# EAGLE board LibreSolar_BMS48V (EAGLE 7.6.0)
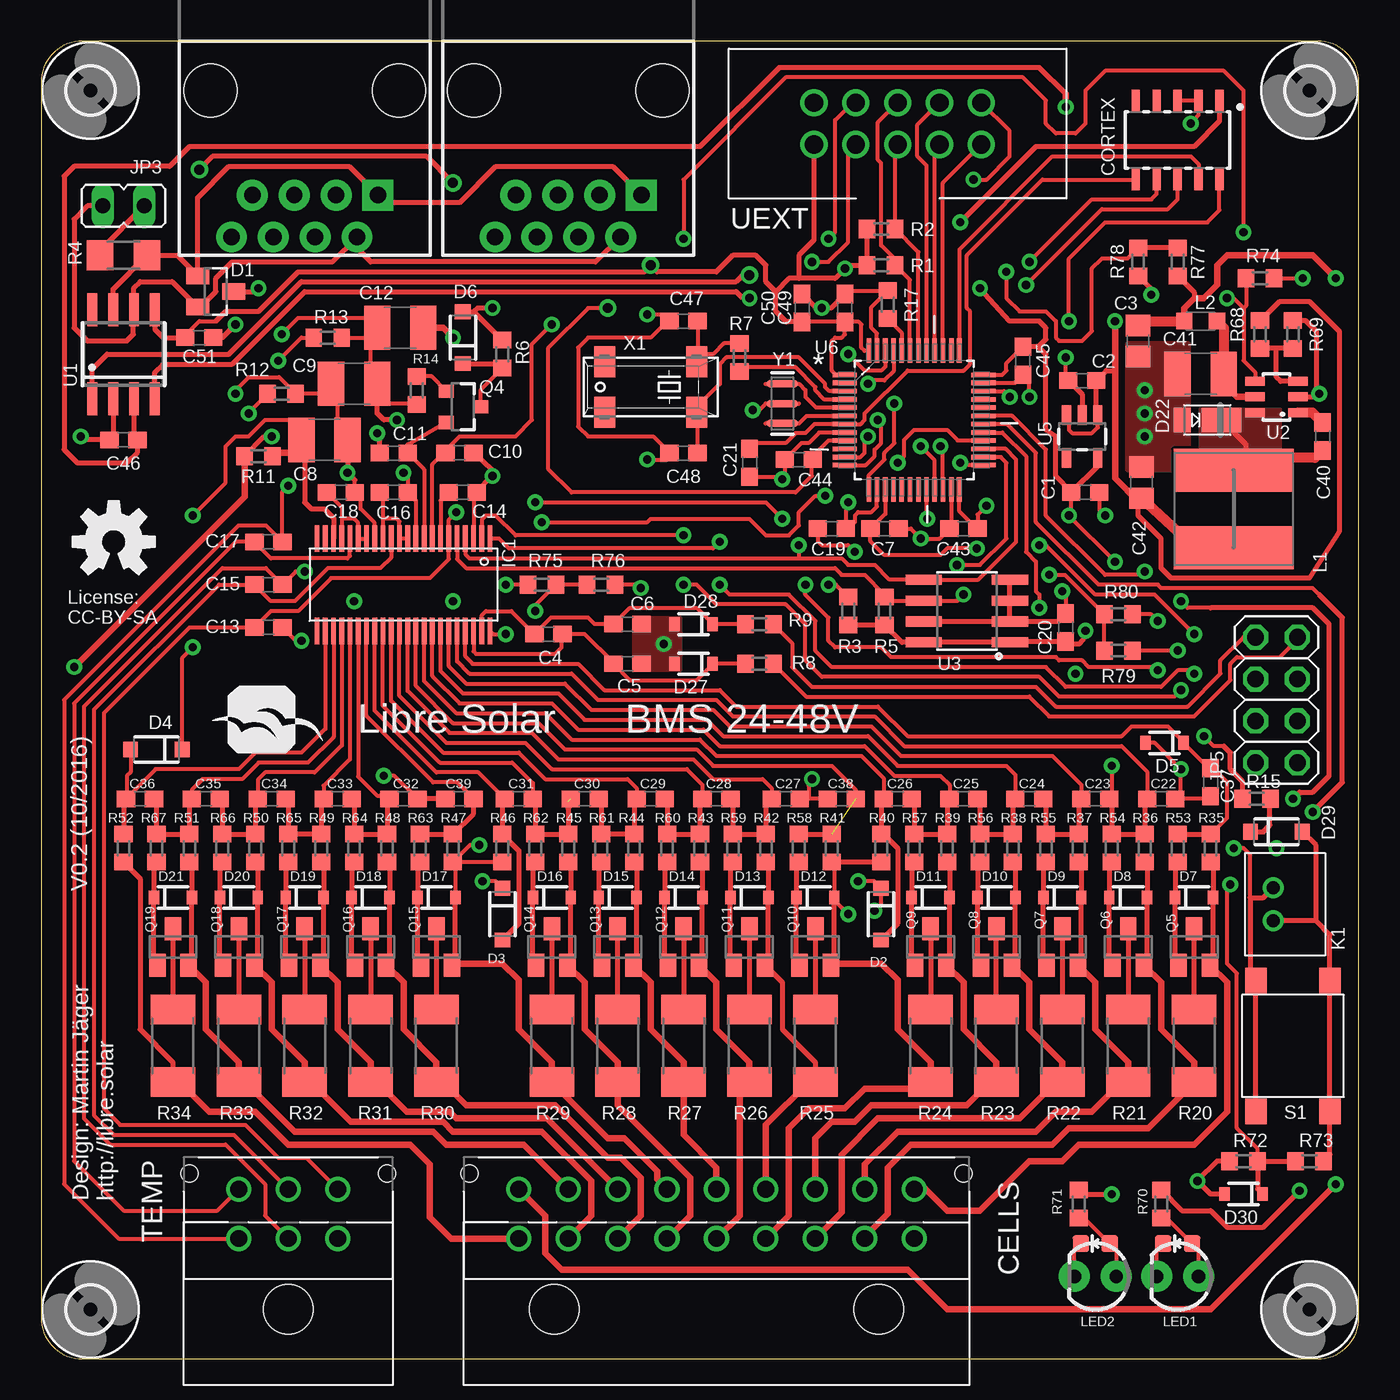
[diagram p2: board, top side]
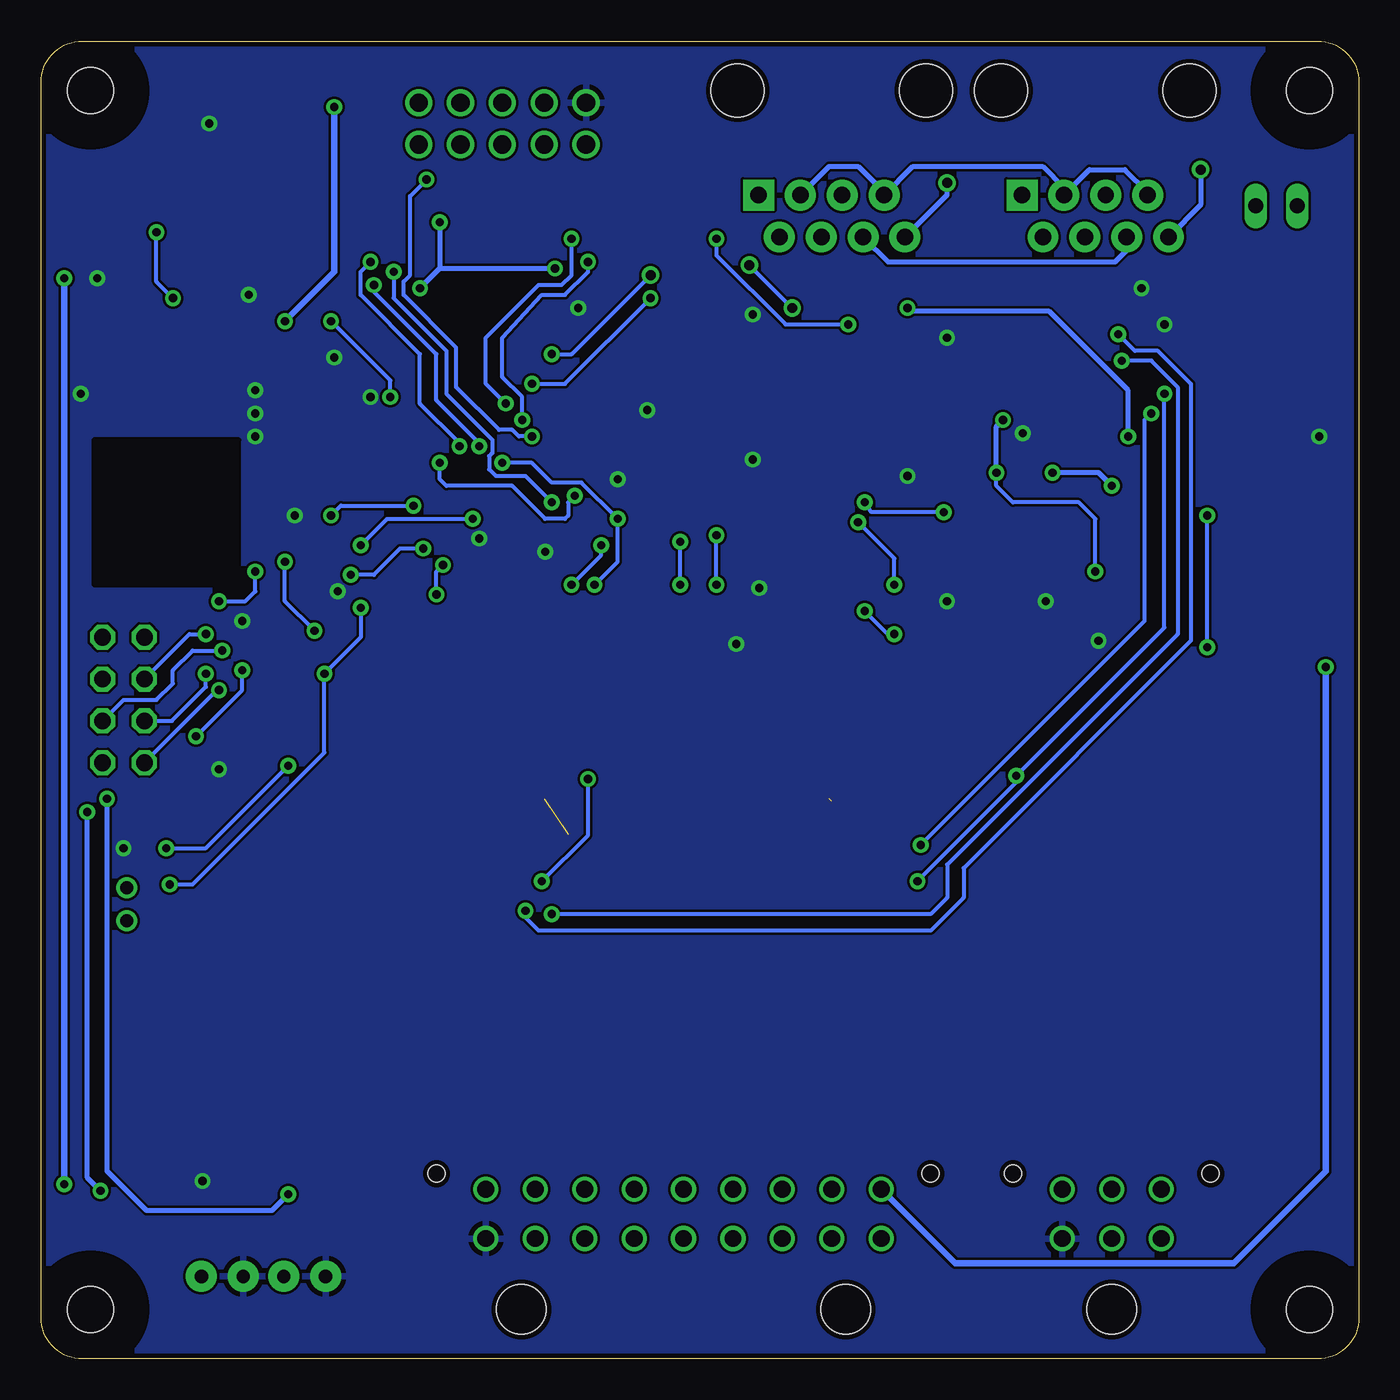
[diagram p3: board, bottom side, seen from below]

Size 80 x 80 mm. Coordinates in mm from the lower left corner, seen from the top.
Outline: 0,77.5 0,2.5 arc90 2.5,0 77.5,0 arc90 80,2.5 80,77.5 arc90 77.5,80 2.5,80 arc90 0,77.5
Copper layers (1*2+3*4+5*6+7*16): Top 0.035mm / dielectric 0.2mm / layer 2 0.035mm / dielectric 0.15mm / layer 3 0.035mm / dielectric 0.2mm / layer 4 0.035mm / dielectric 0.15mm / layer 5 0.035mm / dielectric 0.2mm / layer 6 0.035mm / dielectric 0.15mm / layer 7 0.035mm / dielectric 0.2mm / Bottom 0.035mm
Design rules "Eagle_WEdirekt_150_check": minimum track width 6mil, minimum drill 0.25mm, track to track 6mil, track to pad 8mil, pad to pad 8mil, via to via 6mil, smd to smd 8mil, copper to edge 12mil, drill to drill 24mil, minimum pad ring 9mil, minimum via ring 9mil, stop-mask expansion 3mil, vias tented up to drill 0mil, thermal gap 12mil
Net classes: 0 default: width 0.203 mm, drill 0.3 mm, clearance 0.152 mm; 1 power: width 0.203 mm, drill 0.5 mm, clearance 0.152 mm; 2 VIN: width 0.203 mm, drill 0.3 mm, clearance 0.152 mm
bRestrict: area 68,47 to 76.8,55.8

## Footprints (pad centres in the part's own frame; a part is rotated, then mirrored left to right if it is on the bottom)
C0603 = smd 1.1 x 1: 1 -0.85,0; 2 0.85,0
C0805 = smd 1.3 x 1.5: 1 -0.95,0; 2 0.95,0
C1210 = smd 1.6 x 2.7: 1 -1.4,0; 2 1.4,0
66201821022 = drill 1.02: 1 12,4.3; 2 9,4.3; 3 6,4.3; 4 3,4.3; 5 0,4.3; 6 -3,4.3; 7 -6,4.3; 8 -9,4.3; 9 -12,4.3; 10 12,7.3; 11 9,7.3; 12 6,7.3; 13 3,7.3; 14 0,7.3; 15 -3,7.3; 16 -6,7.3; 17 -9,7.3; 18 -12,7.3 | hole 3: 9.85,0; -9.85,0
SAMTECH_FTSH-105-01 = smd 0.508 x 1.27: 1 -2.54,-2.413; 2 -2.54,2.413; 3 -1.27,-2.413; 4 -1.27,2.413; 5 0,-2.413; 6 0,2.413; 7 1.27,-2.413; 8 1.27,2.413; 9 2.54,-2.413; 10 2.54,2.413
SOT23 = smd 1 x 1.4: 1 -0.95,-1.1; 2 0.95,-1.1; 3 0,1.1
SOD-123 = smd 0.9 x 0.95: A 1.575,0; C -1.575,0
SOD-323 = smd 0.63 x 0.83: A 1.15,0; C -1.15,0
POWERDI123 = smd 1.05 x 1.5: A -1.525,0 | smd 2.4 x 1.5: C 0.85,0
LED-0603 = smd 1 x 1: A 0,-0.877; C 0,0.877
2,8 = hole 2.8: 0,0
TSSOP44 = smd 1.6 x 0.29: 1 -2.8,5.25; 2 -2.8,4.75; 3 -2.8,4.25; 4 -2.8,3.75; 5 -2.8,3.25; 6 -2.8,2.75; 7 -2.8,2.25; 8 -2.8,1.75; 9 -2.8,1.25; 10 -2.8,0.75; 11 -2.8,0.25; 12 -2.8,-0.25; 13 -2.8,-0.75; 14 -2.8,-1.25; 15 -2.8,-1.75; 16 -2.8,-2.25; 17 -2.8,-2.75; 18 -2.8,-3.25; 19 -2.8,-3.75; 20 -2.8,-4.25; 21 -2.8,-4.75; 22 -2.8,-5.25; 23 2.8,-5.25; 24 2.8,-4.75; 25 2.8,-4.25; 26 2.8,-3.75; 27 2.8,-3.25; 28 2.8,-2.75; 29 2.8,-2.25; 30 2.8,-1.75; 31 2.8,-1.25; 32 2.8,-0.75; 33 2.8,-0.25; 34 2.8,0.25; 35 2.8,0.75; 36 2.8,1.25; 37 2.8,1.75; 38 2.8,2.25; 39 2.8,2.75; 40 2.8,3.25; 41 2.8,3.75; 42 2.8,4.25; 43 2.8,4.75; 44 2.8,5.25
RJ45-8 = drill 1 pad 1.88 square: 1 -4.445,6.35 | drill 1 pad 1.88: 2 -3.175,8.89; 3 -1.905,6.35; 4 -0.635,8.89; 5 0.635,6.35; 6 1.905,8.89; 7 3.175,6.35; 8 4.445,8.89 | hole 3.2: -5.715,0; 5.715,0
JP1 = drill 0.914 long: 1 0,-1.27; 2 0,1.27
2X04 = drill 1.016 octagon: 1 -3.81,-1.27; 2 -3.81,1.27; 3 -1.27,-1.27; 4 -1.27,1.27; 5 1.27,-1.27; 6 1.27,1.27; 7 3.81,-1.27; 8 3.81,1.27
62000211622 = drill 0.8: 1 1,0; 2 -1,0
66200621122 = drill 1.02: 1 3,-1.5; 2 0,-1.5; 3 -3,-1.5; 4 3,1.5; 5 0,1.5; 6 -3,1.5 | hole 1.02: -6,2.44; 6,2.44
66201821122 = drill 1.02: 1 12,-1.5; 2 9,-1.5; 3 6,-1.5; 4 3,-1.5; 5 0,-1.5; 6 -3,-1.5; 7 -6,-1.5; 8 -9,-1.5; 9 -12,-1.5; 10 12,1.5; 11 9,1.5; 12 6,1.5; 13 3,1.5; 14 0,1.5; 15 -3,1.5; 16 -6,1.5; 17 -9,1.5; 18 -12,1.5 | hole 1.02: -15,2.44; 15,2.44
WE-TPC_6823 = smd 2.6 x 7.3: 1 -2.35,0; 2 2.35,0
L2012C = smd 1 x 1: 1 -1,0; 2 1,0
LED3MM = drill 0.813 pad 1.88: A -1.27,0; K 1.27,0
SOT23-3 = smd 0.8 x 0.9: 1 -0.95,-1; 2 0.95,-1; 3 0,1.1
R0603 = smd 1 x 1.1: 1 -0.85,0; 2 0.85,0
R1206 = smd 1.6 x 1.803: 1 -1.422,0; 2 1.422,0
R2010 = smd 1.8 x 2.7: 1 -2.2,0; 2 2.2,0
430182050816 = smd 1.55 x 1.3: 1 -3.975,2.25; 2 -3.975,-2.25; 3 3.975,2.25; 4 3.975,-2.25
66200621022 = drill 1.02: 1 3,4.3; 2 0,4.3; 3 -3,4.3; 4 3,7.3; 5 0,7.3; 6 -3,7.3 | hole 3: 0,0
SOIC-8-N = smd 0.6 x 2: 1 -1.905,-2.7; 2 -0.635,-2.7; 3 0.635,-2.7; 4 1.905,-2.7; 5 1.905,2.7; 6 0.635,2.7; 7 -0.635,2.7; 8 -1.905,2.7
SOT23-6 = smd 0.55 x 1.2: 1 0.95,1.3; 2 0,1.3; 3 -0.95,1.3; 4 -0.95,-1.3; 5 0,-1.3; 6 0.95,-1.3
SO08 = smd 0.61 x 2.21: 1 -1.905,-2.616; 2 -0.635,-2.616; 3 0.635,-2.616; 4 1.905,-2.616; 5 1.905,2.616; 6 0.635,2.616; 7 -0.635,2.616; 8 -1.905,2.616
SOT23-5 = smd 0.55 x 1.2: 1 -0.95,-1.3; 2 0,-1.3; 3 0.95,-1.3; 4 0.95,1.3; 5 -0.95,1.3
QFP50P900X900X160-48N = smd 1.473 x 0.279: 1 -4.216,2.743; 2 -4.216,2.261; 3 -4.216,1.753; 4 -4.216,1.245; 5 -4.216,0.762; 6 -4.216,0.254; 7 -4.216,-0.254; 8 -4.216,-0.762; 9 -4.216,-1.245; 10 -4.216,-1.753; 11 -4.216,-2.261; 12 -4.216,-2.743; 25 4.216,-2.743; 26 4.216,-2.261; 27 4.216,-1.753; 28 4.216,-1.245; 29 4.216,-0.762; 30 4.216,-0.254; 31 4.216,0.254; 32 4.216,0.762; 33 4.216,1.245; 34 4.216,1.753; 35 4.216,2.261; 36 4.216,2.743 | smd 0.279 x 1.473: 13 -2.743,-4.216; 14 -2.261,-4.216; 15 -1.753,-4.216; 16 -1.245,-4.216; 17 -0.762,-4.216; 18 -0.254,-4.216; 19 0.254,-4.216; 20 0.762,-4.216; 21 1.245,-4.216; 22 1.753,-4.216; 23 2.261,-4.216; 24 2.743,-4.216; 37 2.743,4.216; 38 2.261,4.216; 39 1.753,4.216; 40 1.245,4.216; 41 0.762,4.216; 42 0.254,4.216; 43 -0.254,4.216; 44 -0.762,4.216; 45 -1.245,4.216; 46 -1.753,4.216; 47 -2.261,4.216; 48 -2.743,4.216
UEXT = drill 1.1: 1 -1.27,5.08; 2 1.27,5.08; 3 -1.27,2.54; 4 1.27,2.54; 5 -1.27,0; 6 1.27,0; 7 -1.27,-2.54; 8 1.27,-2.54; 9 -1.27,-5.08; 10 1.27,-5.08
MM20SS = smd 1.27 x 1.88: 1 -2.794,-1.524; 2 2.794,-1.524; 3 2.794,1.524; 4 -2.794,1.524
RESONATOR-SMD-1:1 = smd 0.45 x 1.905: 1 -1.2,0; 2 0,0; 3 1.2,0

## Placement (x,y rotation side)
C1  2.2µ  [C0603]  63.4,52.6 0 top
C2  1µ  [C0603]  63.2,59.4 180 top
C3  1µ  [C0805]  66.6,61.8 270 top
C4  100n  [C0603]  30.8,44 180 top
C5  100n  [C0603]  35.6,42.2 0 top
C6  100n  [C0603]  35.6,44.6 0 top
C7  100n  [C0603]  51.2,50.4 0 top
C8  10µ  [C1210]  17.2,55.8 0 top
C9  10µ  [C1210]  19,59.2 0 top
C10  1µ  [C0603]  25.4,55 0 top
C11  1µ  [C0603]  21.4,55 180 top
C12  10µ  [C1210]  21.8,62.6 0 top
C13  4.7n  [C0603]  13.8,44.4 0 top
C14  1µ  [C0603]  25.6,52.6 0 top
C15  4.7n  [C0603]  13.8,47 0 top
C16  1µ  [C0603]  21.4,52.6 0 top
C17  4.7n  [C0603]  13.8,49.6 0 top
C18  1µ  [C0603]  18.2,52.6 0 top
C19  100n  [C0603]  48,50.4 180 top
C20  100n  [C0603]  62.2,44.4 90 top
C21  100n  [C0603]  43,54.4 270 top
C22  100n  [C0603]  68,34 0 top
C23  100n  [C0603]  64,34 0 top
C24  100n  [C0603]  60,34 0 top
C25  100n  [C0603]  56,34 0 top
C26  100n  [C0603]  52,34 0 top
C27  100n  [C0603]  45.2,34 0 top
C28  100n  [C0603]  41,34 0 top
C29  100n  [C0603]  37,34 0 top
C30  100n  [C0603]  33,34 0 top
C31  100n  [C0603]  29,34 0 top
C32  100n  [C0603]  22,34 0 top
C33  100n  [C0603]  18,34 0 top
C34  100n  [C0603]  14,34 0 top
C35  100n  [C0603]  10,34 0 top
C36  100n  [C0603]  6,34 0 top
C37  100n  [C0603]  71,35 270 top
C38  100n  [C0603]  48.6,34 0 top
C39  100n  [C0603]  25.4,34 0 top
C40  100n  [C0603]  77.8,56 270 top
C41  2.2µ  [C1210]  70.4,59.8 180 top
C42  22µ  [C0805]  66.8,53.2 90 top
C43  100n  [C0603]  56,50.4 180 top
C44  100n  [C0603]  46,54.6 180 top
C45  100n  [C0603]  59.6,60.6 270 top
C46  100n  [C0603]  5,55.8 180 top
C47  12.5p  [C0603]  39,63 180 top
C48  12.5p  [C0603]  39,55 180 top
C49  100n  [C0603]  48.8,63.8 90 top
C50  2.2µ  [C0603]  46.2,63.8 90 top
C51  100n  [C0603]  9.6,62 0 top
CELLS  [66201821022]  41,3 0 top
CORTEX  CORTEX_DEBUGSMD  [SAMTECH_FTSH-105-01]  69,74 180 top
D1  PESD2CAN  [SOT23]  10.6,64.8 270 top
D2  1N4148W  [SOD-123]  51,27 270 top
D3  1N4148W  [SOD-123]  28,27 270 top
D4  1N4148W  [SOD-123]  7,37 180 top
D5  3.3V  [SOD-323]  68.2,37.4 180 top
D6  1N4148W  [SOD-123]  25.6,62 90 top
D7  5.6V  [SOD-323]  70,28 0 top
D8  5.6V  [SOD-323]  66,28 0 top
D9  5.6V  [SOD-323]  62,28 0 top
D10  5.6V  [SOD-323]  58,28 0 top
D11  5.6V  [SOD-323]  54,28 0 top
D12  5.6V  [SOD-323]  47,28 0 top
D13  5.6V  [SOD-323]  43,28 0 top
D14  5.6V  [SOD-323]  39,28 0 top
D15  5.6V  [SOD-323]  35,28 0 top
D16  5.6V  [SOD-323]  31,28 0 top
D17  5.6V  [SOD-323]  24,28 0 top
D18  5.6V  [SOD-323]  20,28 0 top
D19  5.6V  [SOD-323]  16,28 0 top
D20  5.6V  [SOD-323]  12,28 0 top
D21  5.6V  [SOD-323]  8,28 0 top
D22  DFLS1100-7  [POWERDI123]  70.8,57 0 top
D24  [LED-0603]  69,7 90 top
D26  [LED-0603]  64,7 90 top
D27  3.3V  [SOD-323]  39.6,42.2 180 top
D28  3.3V  [SOD-323]  39.6,44.6 180 top
D29  1N4148W  [SOD-123]  75,32 0 top
D30  3.3V  [SOD-323]  73,10 180 top
H1  MOUNT-HOLE2.8  [2,8]  3,77 0 top
H2  MOUNT-HOLE2.8  [2,8]  3,3 0 top
H3  MOUNT-HOLE2.8  [2,8]  77,77 0 top
H4  MOUNT-HOLE2.8  [2,8]  77,3 0 top
IC1  BQ76940  [TSSOP44]  22,47 270 top
JP1  RJ45  [RJ45-8]  16,77 180 top
JP2  RJ45  [RJ45-8]  32,77 180 top
JP3  [JP1]  5,70 90 top
JP5  [2X04]  75,40 90 top
K1  62000211622  [62000211622]  74.8,27.6 270 top
K4  66200621122  [66200621122]  15,8.8 0 top
K5  66201821122  [66201821122]  41,8.8 0 top
L1  47uH  [WE-TPC_6823]  72.4,51.6 270 top
L2  4.7uH  [L2012C]  70.4,63 180 top
LED1  [LED3MM]  69,5 180 top
LED2  [LED3MM]  64,5 180 top
N1  OSHW-LOGOM  [OSHW-LOGO-M]  4.4,49.6 0 top
Q4  BSS123  [SOT23-3]  25.6,57.8 270 top
Q5  DMN2004K  [SOT23]  70,25 0 top
Q6  DMN2004K  [SOT23]  66,25 0 top
Q7  DMN2004K  [SOT23]  62,25 0 top
Q8  DMN2004K  [SOT23]  58,25 0 top
Q9  DMN2004K  [SOT23]  54,25 0 top
Q10  DMN2004K  [SOT23]  47,25 0 top
Q11  DMN2004K  [SOT23]  43,25 0 top
Q12  DMN2004K  [SOT23]  39,25 0 top
Q13  DMN2004K  [SOT23]  35,25 0 top
Q14  DMN2004K  [SOT23]  31,25 0 top
Q15  DMN2004K  [SOT23]  24,25 0 top
Q16  DMN2004K  [SOT23]  20,25 0 top
Q17  DMN2004K  [SOT23]  16,25 0 top
Q18  DMN2004K  [SOT23]  12,25 0 top
Q19  DMN2004K  [SOT23]  8,25 0 top
R1  2.2k  [R0603]  51,66.4 180 top
R2  2.2k  [R0603]  51,68.6 180 top
R3  2.2k  [R0603]  49,45.4 270 top
R4  120  [R1206]  5,67 180 top
R5  2.2k  [R0603]  51.2,45.4 270 top
R6  t.b.d.  [R0603]  28,61 270 top
R7  0R  [R0603]  42.4,60.8 90 top
R8  1k  [R0603]  43.6,42.2 180 top
R9  1k  [R0603]  43.6,44.6 180 top
R11  100  [R0603]  13.2,54.8 0 top
R12  100  [R0603]  14.6,58.6 0 top
R13  100  [R0603]  17.4,62 0 top
R14  100k  [R0603]  22.8,58.8 90 top
R15  5.6k  [R0603]  73.8,34 0 top
R17  10k  [R0603]  51.4,64 270 top
R20  33  [R2010]  70,19 90 top
R21  33  [R2010]  66,19 90 top
R22  33  [R2010]  62,19 90 top
R23  33  [R2010]  58,19 90 top
R24  33  [R2010]  54,19 90 top
R25  33  [R2010]  47,19 90 top
R26  33  [R2010]  43,19 90 top
R27  33  [R2010]  39,19 90 top
R28  33  [R2010]  35,19 90 top
R29  33  [R2010]  31,19 90 top
R30  33  [R2010]  24,19 90 top
R31  33  [R2010]  20,19 90 top
R32  33  [R2010]  16,19 90 top
R33  33  [R2010]  12,19 90 top
R34  33  [R2010]  8,19 90 top
R35  1k  [R0603]  71,31 90 top
R36  1k  [R0603]  67,31 90 top
R37  1k  [R0603]  63,31 90 top
R38  1k  [R0603]  59,31 90 top
R39  1k  [R0603]  55,31 90 top
R40  1k  [R0603]  51,31 90 top
R41  1k  [R0603]  48,31 90 top
R42  1k  [R0603]  44,31 90 top
R43  1k  [R0603]  40,31 90 top
R44  1k  [R0603]  36,31 90 top
R45  1k  [R0603]  32,31 90 top
R46  1k  [R0603]  28,31 90 top
R47  1k  [R0603]  25,31 90 top
R48  1k  [R0603]  21,31 90 top
R49  1k  [R0603]  17,31 90 top
R50  1k  [R0603]  13,31 90 top
R51  1k  [R0603]  9,31 90 top
R52  1k  [R0603]  5,31 90 top
R53  10k  [R0603]  69,31 270 top
R54  10k  [R0603]  65,31 270 top
R55  10k  [R0603]  61,31 270 top
R56  10k  [R0603]  57,31 270 top
R57  10k  [R0603]  53,31 270 top
R58  10k  [R0603]  46,31 270 top
R59  10k  [R0603]  42,31 270 top
R60  10k  [R0603]  38,31 270 top
R61  10k  [R0603]  34,31 270 top
R62  10k  [R0603]  30,31 270 top
R63  10k  [R0603]  23,31 270 top
R64  10k  [R0603]  19,31 270 top
R65  10k  [R0603]  15,31 270 top
R66  10k  [R0603]  11,31 270 top
R67  10k  [R0603]  7,31 270 top
R68  56k  [R0603]  74,62.2 90 top
R69  10k  [R0603]  76,62.2 270 top
R70  330  [R0603]  68,9.4 90 top
R71  330  [R0603]  63,9.4 90 top
R72  100k  [R0603]  73,12 0 top
R73  10k  [R0603]  77,12 0 top
R74  100k  [R0603]  74,65.6 180 top
R75  1k  [R0603]  30.4,47 180 top
R76  1M  [R0603]  34,47 180 top
R77  100k  [R0603]  69,66.6 270 top
R78  5.6k  [R0603]  66.6,66.6 90 top
R79  100k  [R0603]  65.4,43 0 top
R80  5.6k  [R0603]  65.4,45.2 180 top
S1  [430182050816]  76,19 90 top
TEMP  66200621022  [66200621022]  15,3 0 top
U1  TJA1042T/3  [SOIC-8-N]  5,61 0 top
U2  LMR16006X  [SOT23-6]  75,58.4 270 top
U3  M24256-BW  [SO08]  56.2,45.4 90 top
U5  MIC5225  [SOT23-5]  63.2,56 180 top
U6  STM32F072CB  [QFP50P900X900X160-48N]  53,57 0 top
U$1  LIBRESOLAR_LOGO  [LIBRESOLAR_LOGO]  11.4,36.8 0 top
UEXT  UEXT  [UEXT]  52,75 90 top
X1  ABS25-32.768KHZ-T  [MM20SS]  37,59 180 top
Y1  8MHz  [RESONATOR-SMD-1:1]  45,58 270 top

## Tracks (layer width: path | path; a pad name or v marks a point on that pad's centre or on a via)
!RESET
  Top 0.254: C21.1 43.35,55.6 45.2,55.6 45.8,56.2 46.4,56.2 46.95,56.75 U6.7 49.75,56.75 50,57 50,57.4 52.6,60 56,60 56.4,60.4 56.4,63.6 56.2,63.8 56.2,67 60.79,71.59 CORTEX.10
+3V3  (via drill 0.5, 0.6)
  Top 0.254: 8.75,62.15 9.6,63 10.6,63 | U6.48 50.24,61.2 50,61.2 49.8,61.4 49.8,62.8 49.65,62.95 C49.1 | U6.24 55.74,51.46 56.8,50.4 C43.1 56.85,51.25 v57.4,51.8 | 63.25,43.65 63.4,43.8 v63.4,44.2 | 62.6,52.55 C1.1 62.55,51.35 v62.4,51.2 v65.2,48.4 | U6.36 58.34,59.74 58.6,60 58.6,60.45 C45.1 | C49.1 C50.1 | U6.1 48.26,59.74 48,60 48,61.8 48.2,62 48.6,62 48.8,62.2 C49.1 | 48.76,55.76 U6.9 47.8,55.76 46.85,54.8 C44.1 46.8,54.55 46.8,53.6 45.8,52.6 32.2,52.6 30.8,54 30.8,61.4 33.2,63.8 v34.4,63.8
  Top 0.305: U1.5 6.91,62.49 7.4,62 C51.1 8.75,62.15 | 10.6,63 11.2,63.6 13.2,63.6 15.6,66 36.6,66 v37,66.4 37.4,66 41,66 42,67 43.4,67 44,66.4 44,65.4 44.6,64.8 | 63.25,43.65 63,43.4 62.35,43.4 C20.1 58.87,43.55 U3.1 U3.8 52.26,43.49 R5.2 R3.2 | U5.5 64.15,54.2 C1.1 62.55,52.65 61.6,53.6 61.6,56 61,56.4 61,61 60.55,61.45 | 60.55,61.45 C45.1 | 60.55,61.45 61,61.9 61,62.6 60.6,63 58.8,63 v57,65 | R2.2 R1.2 49,66.4 v48.8,66.2 48.2,65.6 46,65.6 | 46,65.6 45.4,65.6 44.6,64.8 | CORTEX.1 71.54,75.14 70,73.6 60.4,73.6 v55.8,69 | UEXT.1 46.92,67.92 46,67 46,65.6 | C50.1 45.25,62.95 44.6,63.6 44.6,64.8
  Bottom 0.254: v63.4,44.2 65.2,46 v65.2,48.4 | v62.4,51.2 61.8,51.8 v57.4,51.8 | v37,66.4 v34.4,63.8
  Bottom 0.305: v57,65 55.8,66.2 | 55.8,66.2 v48.8,66.2 | v55.8,69 55.8,66.2
+5V  (via drill 0.5)
  Top 0.254: U5.3 62.4,57.15 62.4,56.4 62.6,56.2 63.8,56.2 64.15,56.55 U5.1
  Top 0.305: R68.2 74.05,63.05 75.2,64.2 77,64.2 78.8,62.4 78.8,50.2 77,47.4 68.6,47.4 68,48 68,49.8 66.6,51.2 66.6,52.05 C42.1 | U1.3 5.63,56.02 C46.1 5.85,55.05 5.2,54.4 2.2,54.4 1.4,55.2 1.4,71.8 2,72.4 7.8,72.4 9,73.6 40,73.6 44.8,78.4 60.6,78.4 62.2,76.8 | L1.2 72.4,49.6 73,50.2 | 64.2,57 64.2,57.25 U5.1 64.05,57.4 C2.1 64.65,60 65.2,60
  Top 0.406: C42.1 66.75,52 | 66.6,52.05 65.2,53.45 65.2,60 v65.2,63 | v62.2,76 62.2,76.8
  Top 0.61: C42.1 69,50.2 73,50.2 73.3,50.2 | 66.75,52 67,52
  Bottom 0.406: v65.2,63 62.2,66 v62.2,76
ALERT  (via drill 0.5)
  Top 0.254: R76.2 R75.1 30,45.75 v30,45.4 | IC1.44 27.45,44 v28.2,44
  Bottom 0.254: v28.2,44 28.6,44 v30,45.4
ALERT_IN  (via drill 0.5)
  Top 0.254: R75.2 v28.2,47 | v30.4,50.8 36.8,50.8 37,51 43,51 44,50 45.4,50 46,50.6 46,51.4 47,52.4 v47.6,52.4 | U6.25 55.94,54.26 v55.8,54.4
  Bottom 0.254: v28.2,47 28.2,48.6 v30.4,50.8 | v47.6,52.4 48,52 48,51.2 48.2,51 49.4,51 51.4,53 55.4,53 55.8,53.4 v55.8,54.4
BAT  (via drill 0.5)
  Top 0.254: D4.C 8.57,42.58 v9.2,43.2 | C8.1 15.4,56.2 15.4,57 13.6,57 12.6,56 11.8,56 11.2,55.4 11.2,53.2 v9.2,51.2
  Top 0.305: IC1.20 17.75,51.05 17.2,51.6 16.4,51.6 16,52 16,55.6 C8.1 15.8,55 15.8,54.8
  Top 0.406: R11.2 14.25,55 15.8,55
  Bottom 0.254: v9.2,43.2 v9.2,51.2
BTN  (via drill 0.5)
  Top 0.254: R72.2 73.85,12.75 72.6,14 72.6,23.4 72,24 72,28.6 v72.2,28.8 | U6.29 58.36,56.24 59.8,54.8 59.8,49 60.4,48.4 60.4,46.6 60.6,46.4 v60.6,45.6
  Top 0.305: D30.C 73.85,10.3 R72.2 R73.1
  Bottom 0.254: v72.2,28.8 70.8,28.8 62.8,36.8 v62.8,41.6 60.6,43.8 v60.6,45.6
C0
  Top 0.305: R35.1 71.15,30 D7.A 71.15,24.1 Q5.2
  Top 0.406: K5.10 53.7,10.3 55,9 57,9 60,12 62,12 63,13 70,13 72,15 72,22.85 Q5.2
C1
  Top 0.305: R36.1 67.15,30 D8.A 67.15,24.1 Q6.2
  Top 0.406: Q6.2 68,22.85 68,20 70,18 R20.1 67.2,14 62.4,14 61.4,13 52.8,13 51.4,11.6 51.4,8.8 50,7.4 K5.2
C2
  Top 0.305: Q7.2 63.15,24.1 D9.A 63.15,30 R37.1
  Top 0.406: Q7.2 64,22.85 64,20 66,18 R21.1 65.4,16.2 65,16.2 63.8,15 61.6,15 60.4,13.8 52,13.8 50,11.8 K5.11
C3
  Top 0.305: Q8.2 59.15,24.1 D10.A 59.15,30 R38.1
  Top 0.406: Q8.2 60,22.85 60,20 62,18 R22.1 61.6,16.8 59.4,14.6 50.8,14.6 48.6,12.4 48.6,8.9 K5.3
C4
  Top 0.305: R39.1 55.15,30 D11.A 55.15,24.1 Q9.2
  Top 0.406: Q9.2 56,22.85 56,20 58,18 R23.1 | R23.1 57.6,16.8 | K5.12 47,13.4 48,14.4 49.4,14.4 50.4,15.4 56.2,15.4 57.4,16.6 57.8,16.6 R23.1
C5  (via drill 0.5)
  Top 0.254: R41.1 48.15,30 D12.A 48.15,27.85 v49,27 | v14.4,60.6 15.8,62 R13.1
  Top 0.305: D12.A 48.15,24.1 Q10.2 48.05,24 | R40.1 R41.1
  Top 0.406: 48.05,24 51,24 52,23 52,20 54,18 R24.1 53.6,16.4 50,16.4 48.8,15.2 46.6,15.2 45.4,14 45.4,8.7 K5.4
  Bottom 0.254: v49,27 26,27 25,28 25,30 11,44 11,59 12.6,60.6 v14.4,60.6
C6
  Top 0.305: R42.1 44.15,30 D13.A 44.15,24.1 Q11.2 45,22.85 45,20 47,18 R25.1
  Top 0.406: R25.1 46.6,16.8 44,14.2 K5.13
C7
  Top 0.305: R43.1 40.15,30 D14.A 40.15,24.1 Q12.2
  Top 0.406: Q12.2 41,22.85 41,20 43,18 R26.1 42.4,16.2 42.4,8.7 K5.5
C8
  Top 0.305: R44.1 36.15,30 D15.A 36.15,24.1 Q13.2
  Top 0.406: Q13.2 37,22.85 37,20 39,18 R27.1 39,13.6 41,11.6 K5.14
C9
  Top 0.305: R45.1 32.15,30 D16.A 32.15,24.1 Q14.2
  Top 0.406: Q14.2 33,22.85 33,20 35,18 R28.1 35,15.4 39.4,11 39.4,8.7 K5.6
C10  (via drill 0.5)
  Top 0.254: R46.1 R47.1 | R47.1 25.15,30 D17.A | R47.1 26.05,31.2 v26.6,31.2 | v12.6,57.4 12.6,57.45 R12.1
  Top 0.305: 25.05,24 Q15.2 25.15,24.1 D17.A 25,28
  Top 0.406: 25.05,24 28,24 29,23 29,20 31,18 R29.1 34.4,13.4 35.4,13.4 37.4,11.4 37.4,10.9 K5.15
  Bottom 0.254: v26.6,31.2 13,44.8 13,57 v12.6,57.4
C11
  Top 0.254: R30.1 24.4,16.8
  Top 0.305: R48.1 21.15,30 D18.A 21.15,24.1 Q16.2
  Top 0.406: Q16.2 22,22.85 22,20 24,18 R30.1 | 24.4,16.8 25.8,15.4 31.2,15.4 34.4,12.2 35.2,12.2 36.4,11 36.4,8.7 K5.7
C12
  Top 0.254: R31.1 20.4,16.8
  Top 0.305: R49.1 17.15,30 D19.A 17.15,24.1 Q17.2
  Top 0.406: Q17.2 18,22.85 18,20 20,18 R31.1 | 20.4,16.8 22.2,15 24.8,15 25.2,14.6 30.7,14.6 K5.16
C13
  Top 0.254: R32.1 16.4,16.8
  Top 0.305: R50.1 13.15,30 D20.A 13.15,24.1 Q18.2
  Top 0.406: Q18.2 14,22.85 14,20 16,18 R32.1 | 16.4,16.8 18.8,14.4 24.4,14.4 25,13.8 30.4,13.8 33.4,10.8 33.4,8.7 K5.8
C14
  Top 0.254: R33.1 12.4,16.8
  Top 0.305: R51.1 9.15,30 D21.A 9.15,24.1 Q19.2
  Top 0.406: Q19.2 10,22.85 10,20 12,18 R33.1 | 12.4,16.8 15.4,13.8 23.8,13.8 24.6,13 29.3,13 K5.17
C15
  Top 0.254: R34.1 8.4,16.8
  Top 0.305: R52.1 6,29.15 6,20 8,18 R34.1
  Top 0.406: 8.4,16.8 10.2,15 13,15 15,13 22.4,13 23.6,11.8 23.6,8.6 24.9,7.3 K5.9
CAN_GND
  Bottom 0.305: JP2.3 32.16,72.4 30.4,72.4 28.82,70.83 JP2.7 27.07,72.4 19.2,72.4 17.91,71.11 JP1.3 16.36,72.2 14.2,72.2 12.82,70.83 JP1.7
CAN_H
  Top 0.305: U1.7 4.37,64.94 R4.1 8.25,67 D1.1 9.5,70.5 11.4,72.4 18.7,72.4 JP1.1 20.89,70.2 25.4,70.2 27.6,72.4 34.7,72.4 JP2.1
CAN_L
  Top 0.305: JP3.2 2.8,70 2,69.2 2,62.6 2.8,61.8 5.2,61.8 5.6,62.2 5.6,63.66 U1.6 5.63,65.03 6,65.4 7.95,65.4 D1.2 9.65,63.85 10.6,64.8 10.6,65.6 11.6,66.6 17.66,66.6 JP1.2 19.18,67.42 20,66.6 33.66,66.6 JP2.2
CAN_RX  (via drill 0.5)
  Top 0.254: U6.45 51.76,59.95 51.2,59.4 50.4,59.4 v50.2,59.2
  Top 0.305: U1.4 6.91,59.91 7.4,60.4 11.6,60.4 16,64.8 42.2,64.8 42.6,64.4 v43,64.4
  Bottom 0.254: v50.2,59.2 48.2,59.2 v43,64.4
CAN_SHLD
  Bottom 0.305: JP2.6 28.59,66.6 14.8,66.6 14.1,67.31 JP1.6
CAN_TX  (via drill 0.5, 0.6)
  Top 0.254: U6.46 51.25,60.25 51,60 50,60 v49,61
  Top 0.305: U1.1 3.1,60.09 4,61 11.4,61 15.8,65.4 42.2,65.4 42.6,65.8 v43,65.8
  Bottom 0.254: v49,61 47.8,61 v43,65.8
CAN_V+  (via drill 0.6)
  Top 0.305: v25,71.4 23.4,73 10.4,73 v9.6,72.2
  Bottom 0.305: JP2.8 25,70.67 v25,71.4 | v9.6,72.2 9.6,70.06 JP1.8
CAP1
  Top 0.254: IC1.7 24.25,52.1 C14.1
CAP2
  Top 0.254: 20.75,51 20.75,52.4 C16.1 | 20.75,51 IC1.14 | IC1.11 IC1.12 21.75,50.85 21.6,51 20.75,51
CAP3
  Top 0.254: 18.25,51 18.25,51.7 C18.1 | 18.25,51 IC1.19 | IC1.16 IC1.17 19.25,50.75 19,51 18.25,51
CHG_EN  (via drill 0.5)
  Top 0.254: v69.2,40.6 68.8,40.2 61.8,40.2 60.6,41.4 47.4,41.4 46.4,42.4 46.4,44.6 45.2,45.8 41,45.8 39.8,47 v39,47 | v39,50 28.8,50 27.6,51.2 27,51.2 26.75,50.95 IC1.2
  Bottom 0.254: JP5.2 69.4,40.52 v69.2,40.6 | v39,47 v39,50
DSG_EN  (via drill 0.5)
  Top 0.254: v70,41.6 69.8,41.8 69,41.8 68,40.8 62.2,40.8 61,42 48,42 47,43 47,44.8 45.4,46.4 41.8,46.4 v41.2,47 | v41.2,49.6 40.8,49.2 28.4,49.2 27.8,49.8 IC1.1
  Bottom 0.254: v41.2,47 v41.2,49.6 | JP5.4 72.07,38.73 70,40.8 v70,41.6
GND  (via drill 0.5)
  Top 0.254: IC1.3 26.25,52.4 C14.2 26.45,52.65 | LED2.K 62.73,6.61 D26.C | LED1.K 67.73,6.61 D24.C | v36.4,46.8 36.2,47 R76.1 | C37.2 70.85,34 C22.2 69.2,34.35 v69.2,35.8 67.6,37.4 D5.A | v15.8,43.6 15.45,43.6 C13.2 | R74.1 v76.6,65.6 | U6.8 47.24,56.24 46.6,55.6 46.15,55.6 C44.2 45.15,53.55 v45,53.4 44.85,53.55 C21.2 | 43.98,58 43.58,57.6 v43.2,57.6 | C2.2 62.2,59.55 v62.2,60.8 | v67.8,44.8 67.4,45.2 R80.1 | C7.2 52.8,50.4 v53.4,49.8 54.55,49.8 C43.2 55.26,50.51 U6.23 | C1.2 64.25,51.55 v64.6,51.2 | CORTEX.5 CORTEX.3 70.27,75.53 v69.8,75 | U6.35 59.11,59.26 C45.2 60,59.35 v60,58.4 | C19.2 47.15,49.65 47.4,49.4 49,49.4 v49.4,49 | U6.47 50.74,62.26 50.4,62.6 50.4,63.85 R17.1 49,64.85 C49.2 | C47.2 38,63 | 38,63 37,62 33.2,62 32.6,61.4 32.6,56.6 33.2,56 37.15,56 C48.2 | 38,63 37.6,63.4 v36.8,63.4 | v36.8,54.6 38,54.6 38,55 | v62,46.6 62.2,46.4 C20.2
  Top 0.305: R69.1 76.75,63.05 77.4,62.4 77.4,58.8 v77.6,58.6 77.4,58.4 U2.2 | C10.2 27.4,53.95 v27.4,53.6 26.45,52.65 | C11.2 20.55,56.05 v20.4,56.2 | D1.3 13,64.8 v13.2,65 | v2.4,56 2.6,55.8 C46.2 4.37,56.02 U1.2 | C51.2 11,62 v11.8,62.8 | D30.A 71,10 v70.2,10.8 71.4,12 R72.1 | C20.2 61.72,44.77 U3.2 | U3.2 U3.3 U3.4 | U3.2 U3.7 | C2.2 63.2,58.55 U5.2 | R78.1 67.4,64.95 v67.4,64.6 | C50.2 47.05,63.8 v47.4,63.8 47.95,63.8 C49.2
  Top 0.406: C12.2 24.4,62.6 v25,62
  other vias: 67,56 37.8,43.4 19,46 25,46 67,57.4 67,58.8 75,31
  pour Bottom: -1,81 81,81 81,-1 -1,-1
  pour Top (no thermals): 69.6,61.6 69.6,54 66,54 66,61.6
  pour Top (no thermals): 36,45 38.8,45 38.8,41.8 36,41.8
I2C1_SCL
  Top 0.254: U6.42 53.25,67.2 R2.1 51.85,73.58 UEXT.5
I2C1_SDA
  Top 0.254: U6.43 52.75,65.5 R1.1 51.85,66.75 51,67.6 51,72.6 50.8,72.8 50.8,75.07 UEXT.6
I2C2_SCL  (via drill 0.5)
  Top 0.254: IC1.5 25.25,48.55 25.8,48 48.2,48 48.6,47.6 50,47.6 51.2,46.4 R5.1 51.41,46.03 U3.6 55.63,46.03 v56,46.4 | v55.6,48.2 57,48.2 58.6,49.8 58.6,54.4 58.26,54.74 U6.26
  Bottom 0.254: v56,46.4 56,47.8 v55.6,48.2
I2C2_SDA  (via drill 0.5)
  Top 0.254: IC1.4 25.75,48.85 26,48.6 46,48.6 | 46,48.6 48.6,48.6 49,48.2 50.6,48.2 51.49,47.3 U3.5 56.91,47.3 59.2,49.6 59.2,54.6 58.55,55.25 U6.27 | R3.1 48.25,47 v47.8,47 | v46,49.4 46,48.6
  Bottom 0.254: v47.8,47 46,48.8 v46,49.4
LED1  (via drill 0.5)
  Top 0.254: 77.6,46.4 77.2,46.8 68,46.8 67.8,47 64.2,47 60.4,50.8 60.4,55 58.65,56.75 U6.30
  Top 0.305: R70.2 69.25,9 71,9 72,8 74.2,8 v76.4,10.2 | v77.2,33.2 79,35 79,45 77.6,46.4
  Bottom 0.305: v76.4,10.2 77.2,11 v77.2,33.2
LED2  (via drill 0.5)
  Top 0.254: 71,45.6 69.6,45.6 v69.2,46 | v67,47.8 66.8,47.6 64.6,47.6 61,51.2 61,55.2 58.95,57.25 U6.31
  Top 0.305: R71.2 63.25,10 v65,10 | v76,34 76.4,34.4 77.2,34.4 78.2,35.4 78.2,44.6 77.2,45.6 71,45.6
  Bottom 0.254: v69.2,46 67.6,46 67,46.6 v67,47.8
  Bottom 0.305: v65,10 66,9 73.6,9 76,11.4 v76,34
LOAD+  (via drill 0.5)
  Top 0.254: v69,43 R79.2
  Bottom 0.254: JP5.3 75,40 73,40 72,41 72,41.8 70.8,43 v69,43
MCU_IN
  Top 0.305: R73.2 78.25,12.4 S1.2 S1.4 78.25,25.75 77.4,26.6 | 77.4,26.6 K1.1 | 77.4,26.6 77.4,31.18 D29.A
N$1
  Top 0.305: Q15.3 R30.2
N$2
  Top 0.305: Q16.3 R31.2
N$3
  Top 0.305: Q17.3 R32.2
N$4
  Top 0.305: R65.2 14.85,30 D19.C 14.85,24.1 Q17.1
N$5
  Top 0.305: Q6.3 R21.2
N$7
  Top 0.305: R64.2 18.85,30 D18.C 18.85,24.1 Q16.1
N$8
  Top 0.305: Q5.1 68.85,24.1 D7.C 68.85,30 R53.2
N$9
  Top 0.406: U2.5 72.6,58.4 72,59 72,59.6 C41.1
  Top 0.61: C41.1 71.8,62.6 L2.1
N$10
  Top 0.305: D29.C 74.2,32 74.6,32.4 74.6,33.95 R15.2
N$11
  Top 0.305: R69.2 75,61.35 | 75,61.35 R68.1 | U2.3 75.25,59.35 75,59.6 75,61.35
N$12
  Top 0.305: R54.2 64.85,30 D8.C 64.85,24.1 Q6.1
N$13
  Top 0.305: R55.2 60.85,30 D9.C 60.85,24.1 Q7.1
N$14
  Top 0.305: R20.2 Q5.3
N$15
  Top 0.305: Q7.3 R22.2
N$16
  Top 0.305: R56.2 56.85,30 D10.C 56.85,24.1 Q8.1
N$17
  Top 0.305: R23.2 Q8.3
N$18
  Top 0.305: Q9.3 R24.2
N$19
  Top 0.305: Q9.1 52.85,24.1 D11.C 52.85,30 R57.2
N$20
  Top 0.305: R58.2 45.85,30 D12.C 45.85,24.1 Q10.1
N$21
  Top 0.305: Q10.3 R25.2
N$22
  Top 0.305: Q11.3 R26.2
N$24
  Top 0.305: R59.2 41.85,30 D13.C 41.85,24.1 Q11.1
N$25
  Top 0.305: Q12.1 37.85,24.1 D14.C 37.85,30 R60.2
N$27
  Top 0.305: Q12.3 R27.2
N$28
  Top 0.305: R61.2 33.85,30 D15.C 33.85,24.1 Q13.1
N$29
  Top 0.305: R28.2 Q13.3
N$30
  Top 0.305: Q14.3 R29.2
N$31
  Top 0.305: R62.2 29.85,30 D16.C 29.85,24.1 Q14.1
N$32
  Top 0.305: R63.2 22.85,30 D17.C 22.85,24.1 Q15.1
N$33
  Top 0.305: R66.2 10.85,30 D20.C 10.85,24.1 Q18.1
N$34
  Top 0.305: Q18.3 R33.2
N$35
  Top 0.305: R67.2 6.85,30 D21.C 6.85,24.1 Q19.1
N$36
  Top 0.305: Q19.3 R34.2
N$37
  Top 0.305: 73.15,54.7 73.15,55.5 D22.C
  Top 0.61: C40.2 77.35,54.7 73.15,54.7 L1.1
  pour Top (no thermals): 75.2,55 75.2,57.6 70.4,57.6 70.4,55
N$39
  Top 0.61: C40.1 77.2,57.45 U2.1
N$40
  Top 0.305: R4.2 3.58,67.31 JP3.1
N$41
  Top 0.254: U6.4 47.55,58.24 47,58.8 47,59 45.8,60.2 42.65,60.2 R7.1
N$42
  Top 0.254: R7.2 41.45,61.65 40.8,61 40.27,61 X1.1 39.85,60.58 C47.1
N$43
  Top 0.254: LED1.A 70.27,6.61 D24.A 68.33,8.55 R70.1
N$44
  Top 0.254: U6.3 47.85,58.75 47.6,59 47.6,59.2 46,60.8 41.6,60.8 41.2,60.4 41.2,59.2 40,58 40,57.68 X1.4 39.85,57.42 C48.1
N$46
  Top 0.254: LED2.A 65.27,6.61 D26.A 63.33,8.55 R71.1
N$49
  Top 0.254: Q4.3 26.7,58.85 R6.2
  Top 0.305: D6.C 27.73,60.42 R6.2
N$51
  Top 0.254: Q4.1 23.7,59.65 R14.2
N$57
  Top 0.254: R17.2 52.24,62.31 U6.44
OSC_IN
  Top 0.254: 46.02,59.2 46.4,58.82 46.4,58.4 47.04,57.76 U6.5
OSC_OUT
  Top 0.254: 46.02,56.8 46.47,57.25 U6.6
PCHG_EN  (via drill 0.5)
  Top 0.254: v70,44 67.6,46.4 64,46.4 61,49.4 v60.6,49.4 | v53.8,51 53.76,51.04 U6.20
  Bottom 0.254: JP5.6 71,44 v70,44 | v60.6,49.4 59,51 v53.8,51
PWR  (via drill 0.5)
  Top 0.305: R11.1 13.55,56 v14,56 | D6.A 26.27,63.58 | 26.27,63.58 R6.1 | v27.4,63.8 26.5,63.8 26.27,63.58 | R77.2 70,64.75 70,64.4
  Top 0.406: v2,42 12.35,52.35 R11.1 | v78.6,65.6 77.2,67 72,67 71.4,66.4 71.4,65.2 70.6,64.4 70,64.4 69.4,63.8 L2.2 | v78.6,10.6 71,3 55,3 52.6,5.4 31.6,5.4 30.6,6.4 30.6,8.7 K5.18
  Top 0.61: C3.1 66.85,63 L2.2
  Bottom 0.305: v14,56 14,58.8 18.8,63.6 27.2,63.6 v27.4,63.8
  Bottom 0.406: K5.18 24.5,5.8 7.6,5.8 2,11.4 v2,42 | v78.6,65.6 v78.6,10.6
R_SENSE+
  Top 0.254: R8.1 46.45,40.2 60,40.2 61.2,39 70,39 72.2,41.2 72.2,42.2 72.6,42.6 75.2,42.6 76.27,43.67 JP5.7
R_SENSE-
  Top 0.254: R9.1 45.6,43.45 45.6,42 46.8,40.8 60.4,40.8 61.6,39.6 69.6,39.6 71.6,41.6 71.6,42.4 73.01,43.81 JP5.8
REGOUT  (via drill 0.5)
  Top 0.254: IC1.8 23.75,54.3 24.45,55 C10.1 24.55,55.15 25.4,56 28.8,56 29.8,57 29.8,61.6 v31,62.8 | R74.2 73.15,63.95 73,63.8 | 73,63.8 73,60.6 73.7,59.9 U2.4 | 73,63.8 72.4,64.4 v72,64.4 | v73,68.4 73,77 71.8,78.2 64.6,78.2 63.4,77 63.4,75 62.8,74.4 61.6,74.4 61,75 61,76.4 59.6,77.8 45.2,77.8 39,71.6 v39,68
  Bottom 0.254: v72,64.4 73,65.4 v73,68.4 | v39,68 39,67 34.8,62.8 v31,62.8
REGSRC
  Top 0.254: IC1.9 23.25,54 C11.1 22.25,55.5 Q4.2
SPI1_MISO
  Top 0.254: U6.40 54.24,73.44 UEXT.7
SPI1_MOSI
  Top 0.254: U6.41 53.76,72.44 53.2,73 53.2,74.93 UEXT.8
SPI1_SCK
  Top 0.254: U6.39 54.75,71.4 UEXT.9
SRN
  Top 0.254: IC1.43 26.75,45.15 27,45.4 28.55,45.4 C4.2 30.95,45 33.2,45 33.6,44.6 C6.1 35.75,45.6 39.8,45.6 40.75,44.65 D28.C R9.2
SRP
  Top 0.254: IC1.42 26.25,42.95 26.4,42.8 31.2,42.8 31.6,43.2 31.6,43.95 C4.1 33,44 34.75,42.25 C5.1 35.75,41.2 39.8,41.2 40.75,42.15 D27.C R8.2
SSEL  (via drill 0.5)
  Top 0.254: U6.11 49.74,54.74 50,55 50,55.8 v50.2,56 | v56.6,71.6 57.4,71.6 58.8,73 58.8,74.55 UEXT.10
  Bottom 0.254: v50.2,56 51,56 51.4,56.4 52.2,56.4 54.8,59 54.8,61.4 58,64.6 58,65.4 57.6,65.8 57.6,70.6 v56.6,71.6
SWCLK
  Top 0.254: U6.37 55.74,67.34 61.4,73 69.8,73 70.27,72.53 CORTEX.4
SWDIO  (via drill 0.5)
  Top 0.254: CORTEX.2 71.54,69.74 70.8,69 64.6,69 62.4,66.8 v62.4,63 | U6.34 58.45,58.75 v58.8,58.4
  Bottom 0.254: v58.8,58.4 58.8,59.4 v62.4,63
TS1  (via drill 0.5)
  Top 0.254: K4.4 16.1,12.2 14.4,12.2 12.4,14.2 4.8,14.2 3.8,15.2 3.8,39.2 9,44.4 C13.1 13.95,45.4 15.6,45.4 17.6,47.4 23.6,47.4 24.75,48.55 IC1.6 24.75,50.95 v25.2,51.4 | v30,52 44,52 v45,51 | 71.8,37.2 71.2,37.2 v70.6,37.8 | v67.8,41.8 67.6,42 63.6,42 63.2,42.4 61.8,42.4 61.6,42.6 51.6,42.6 51,43.2 48.2,43.2 47.8,43.6 47.8,45 46.4,46.4 v46.4,47 | v52,54.4 52.4,54.8 52.4,55.8 53,56.4 55,56.4 55.65,55.76 U6.28
  Top 0.305: R15.1 72.95,35.05 72.2,35.8 72.2,36.8 71.8,37.2
  Bottom 0.254: v25.2,51.4 29.6,51.4 v30,52 | v70.6,37.8 67.8,40.6 v67.8,41.8 | v46.4,47 45,48.4 v45,51 47.2,53.2 49,53.2 50.2,54.4 v52,54.4
TS2
  Top 0.254: IC1.13 21.25,48.65 20.6,48 17.4,48 15.4,46 13.95,46 C15.1 10.8,47 3.2,39.4 3.2,14.8 4.4,13.6 11.7,13.6 K4.5
TS3
  Top 0.254: IC1.18 18.75,48.75 18.6,48.6 13.95,48.6 C17.1 11.8,49.6 2,39.8 2,12 5,9 10.7,9 K4.6
USART2_RX  (via drill 0.5)
  Top 0.254: U6.13 50.26,53.66 51.2,54.6 51.2,55 51.8,55.6 v51.8,58 | v47.8,68 48.2,68.4 48.2,75.2 49.27,76.27 UEXT.4
  Bottom 0.254: v51.8,58 53,59.2 53,62 49.8,65.2 48.4,65.2 47.8,65.8 v47.8,68
USART2_TX  (via drill 0.5)
  Top 0.254: U6.12 50.06,54.26 50.6,54.8 50.6,55.2 51,55.6 51,56.8 v50.8,57 | v46.8,66.6 47.8,66.6 49,67.8 49,73.27 UEXT.3
  Bottom 0.254: v50.8,57 50.8,58.4 52,59.6 52,62 49.6,64.6 48.2,64.6 46.8,66 v46.8,66.6
USART3_RX  (via drill 0.5)
  Top 0.254: U6.22 54.75,55.15 v54.6,55.4 | v60,66.6 63.8,70.4 67.4,70.4 67.73,70.73 CORTEX.8
  Bottom 0.254: v54.6,55.4 54.6,55.6 57,58 57,61 60.6,64.6 60.6,66 v60,66.6
USART3_TX  (via drill 0.5)
  Top 0.254: U6.21 54.24,54.55 v53.4,55.4 | v59.8,65.2 64.4,69.8 68.4,69.8 69,70.4 CORTEX.6
  Bottom 0.254: v53.4,55.4 53.4,55.6 56,58.2 56,61 59.8,64.8 v59.8,65.2
V_BAT  (via drill 0.5)
  Top 0.254: R78.2 65.95,66.8 64.4,66.8 63.8,66.2 63.8,62.4 63.2,61.8 61.8,61.8 61.6,62 61.6,63 61,63.6 59.4,63.6 58.6,64.4 v58.6,66 | C19.1 48.85,50.65 | U6.14 50.74,51.74 50.4,51.4 49.6,51.4 49.4,51.2 49.4,50.8 49,50.4 C19.1 | 48.8,50.35 C19.1 | v49,52 48.85,51.85 C19.1
  Top 0.305: R77.1 R78.2
  Bottom 0.254: v58.6,66 58.6,64.4 55.4,61.2 55.4,58.6 52.6,55.8 52.6,55 52.8,54.8 52.8,54 52.4,53.6 50.6,53.6 v49,52
V_LOAD  (via drill 0.5)
  Top 0.254: R79.1 R80.2 | v56.8,49.2 55,49.2 54.6,48.8 51.2,48.8 50.35,49.65 C7.1 51.25,51.3 U6.15 | 64.35,45.2 R80.2 | v61.2,47.6 62.15,47.6 R80.2
  Bottom 0.254: v56.8,49.2 58.2,49.2 59.8,47.6 v61.2,47.6
VC0
  Top 0.254: R35.2 72,32.85 72,35 71.15,35.85 C37.1 70.9,35.85 D5.C 69.35,37.45 68.4,38.4 66.2,38.4 65.6,37.8 52.6,37.8 50.8,39.6 42.2,39.6 41.2,40.6 34.2,40.6 32.6,42.2 26.2,42.2 25.75,42.65 IC1.41
  Top 0.305: R53.1 R35.2
VC1  (via drill 0.5)
  Top 0.254: C22.1 67,34 | IC1.40 25.25,42.35 26,41.6 32.2,41.6 33.8,40 41,40 42,39 50.6,39 52.4,37.2 65.6,37.2 67.15,35.65 C22.1 | 67,34.15 C22.1 | 73.4,28 73.4,30.6 73,31 v72.4,31 | v65,36 65,34.15 C23.2
  Top 0.305: 67,34 R36.2 R54.1 65,33.85 C23.2 | S1.1 S1.3 73.75,23.05 73.4,23.4 73.4,28 74.2,28 K1.2
  Bottom 0.254: v72.4,31 70,31 v65,36
VC2
  Top 0.254: IC1.39 24.75,42.05 25.8,41 31.8,41 33.4,39.4 40.8,39.4 41.8,38.4 50.4,38.4 52.2,36.6 61.4,36.6 63.15,34.85 C23.1 63,34.15
  Top 0.305: C23.1 63,33.85 R37.2 R55.1 61,33.85 C24.2
VC3
  Top 0.254: IC1.38 24.25,41.75 25.6,40.4 31.4,40.4 33,38.8 40.4,38.8 41.4,37.8 50.2,37.8 52,36 58.6,36 59.15,35.45 C24.1 59.2,34.05
  Top 0.305: C24.1 59,33.85 R38.2 R56.1 57,33.85 C25.2
VC4
  Top 0.254: 55,34.15 C25.1 55.15,34.85 54.6,35.4 51.8,35.4 50,37.2 41.2,37.2 40.2,38.2 32.6,38.2 31,39.8 25.4,39.8 23.75,41.45 IC1.37
  Top 0.305: C26.2 53,33.85 R57.1 R39.2 55,34.15
VC5
  Top 0.254: IC1.36 23.25,41.15 25.2,39.2 30.6,39.2 32.2,37.6 40,37.6 41,36.6 49.8,36.6 51.15,35.25 C26.1
  Top 0.305: C26.1 51,33.85 R40.2 51.15,31.85 52,31 52,26.43 D2.A
VC5B  (1 unrouted)
  Top 0.254: IC1.35 22.75,40.85 25,38.6 30.2,38.6 31.8,37 39.8,37 40.8,36 48,36 49.45,34.55 C38.2
  Top 0.305: R58.1 R41.2
VC5X  (via drill 0.5)
  Top 0.254: IC1.10 22.75,52.1 C16.2 22.25,53.55 v22,53.8 | C38.1 46.6,34 | 46.6,34 C27.2 | v49.6,29 50.58,29 D2.C 51,27.6 v50.6,27.2 | v46.8,35.2 46.6,34.8 46.6,34 | K4.2 13.6,8.7 13.6,10.6 11.2,13 4.2,13 2.6,14.6 2.6,39.6 11,48 13.65,48 C15.2 15.45,47.8 v16,47.8 | R14.1 22.75,58 21,58 20.4,58.6 C9.2 20,59.6 20,62 | v14.6,62.2 15.6,63.2 20,63.2 20.4,62.8 C12.1 20.4,62.4 20,62 | R13.2 20,62
  Top 0.305: v21.6,57 20.8,57 20.4,57.4 20.4,58.6
  Bottom 0.254: v49.6,29 46.8,31.8 v46.8,35.2 | v50.6,27.2 50.6,26.8 49.8,26 26,26 24,28 24,29.8 10.2,43.6 10.2,59.2 12.2,61.2 13.6,61.2 v14.6,62.2 | v16,47.8 16,51 17,52 21,52 22,53 v22,53.8
  Bottom 0.305: v22,53.8 22,56.6 v21.6,57
VC6
  Top 0.254: IC1.34 22.25,40.55 24.8,38 29.8,38 31.4,36.4 39.6,36.4 40.8,35.2 43.8,35.2 44.35,34.65 C27.1
  Top 0.305: C27.1 44,33.65 R42.2 R59.1 42,33.85 C28.2
VC7
  Top 0.254: 40,34 C28.1 40.15,34.85 39.2,35.8 31,35.8 29.4,37.4 24.6,37.4 21.75,40.25 IC1.33
  Top 0.305: 40,34 R43.2 R60.1 38,33.85 C29.2
VC8
  Top 0.254: 36.2,34.05 C29.1 36.15,34.65 35.6,35.2 30.6,35.2 29,36.8 24.4,36.8 21.25,39.95 IC1.32
  Top 0.305: C30.2 34,33.85 R61.1 R44.2 36,33.85 C29.1
VC9  (1 unrouted)
  Top 0.254: IC1.31 20.75,39.65 24.2,36.2 28.6,36.2 29.85,34.95 C31.2 | 32.2,33.6 32,33.4
  Top 0.305: C31.2 30,33.85 R62.1 R45.2 32,33.4 32,33.85
VC10
  Top 0.254: IC1.30 20.25,39.35 24,35.6 26.55,35.6 C31.1 28,34.15
  Top 0.305: C31.1 28,33.85 R46.2 29,30.85 29,26.43 D3.A
VC10B
  Top 0.254: IC1.29 19.75,39.05 23.8,35 25.25,35 C39.2
  Top 0.305: R63.1 R47.2 26.25,33.1 C39.2
VC10X  (via drill 0.5)
  Top 0.254: C9.1 17,58.6 R12.2 14.45,59.6 12.6,59.6 11.8,58.8 v11.8,58.6 | C32.2 21.45,35.4 v20.8,35.4 | K4.3 4.7,7.3 1.4,10.6 1.4,40 12,50.6 13.65,50.6 C17.2 14.65,52.65 v15,53 | 19.05,53.35 C18.2 19.4,52.25 19.4,51.6 20.25,50.75 IC1.15 | D3.C 27.57,29 v26.8,29 | 17.2,59.6 C9.1 | C8.2 18,56.4 18,59 17.8,59.2 C9.1
  Top 0.305: 19.05,53.35 v18.6,53.8 C8.2 | C39.1 C32.2
  Bottom 0.254: v26.8,29 20.8,35 v20.8,35.4 11.8,44.4 v11.8,58.6
  Bottom 0.305: v15,53 15.8,53.8 v18.6,53.8
VC11
  Top 0.254: 21,34.15 C32.1 20.8,34 20.6,34.2 20.4,34.2 19.25,35.35 IC1.28
  Top 0.305: C33.2 19,33.85 R64.1 R48.2 21,33.85 C32.1
VC12
  Top 0.254: IC1.27 18.75,36.4 17.15,34.8 C33.1
  Top 0.305: C33.1 17,33.85 R49.2 R65.1 15,33.85 C34.2
VC13
  Top 0.254: IC1.26 18.25,37.25 16.6,35.6 13.6,35.6 13.15,35.15 C34.1
  Top 0.305: C34.1 13,33.85 R50.2 R66.1 11,33.85 C35.2
VC14
  Top 0.254: IC1.25 17.75,37.75 16.2,36.2 13.2,36.2 12.2,35.2 9.8,35.2 9.15,34.55 C35.1
  Top 0.305: C35.1 9,33.85 R51.2 R67.1 7,33.85 C36.2
VC15
  Top 0.254: IC1.24 17.25,38.25 15.8,36.8 13,36.8 12,35.8 6.95,35.8 C36.1 5.2,34.05 5.2,35.4 5.42,35.62 D4.A
  Top 0.305: C36.1 5,33.85 R52.2

## Text on the board
tPlace: License: / CC-BY-SA | Libre Solar BMS 24-48V | V0.2 (10/2016) | Design: Martin Jäger / http://libre.solar